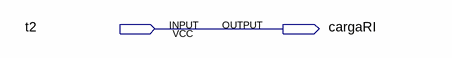
[diagram p0: schematic sheet]
// Quartus schematic cargaRI.bdf as structural Verilog: 0 symbols, 2 pins
module cargaRI (
  input  t2,
  output cargaRI
);


  assign cargaRI = t2;
endmodule
